# Altium project Attiny.PrjPCB
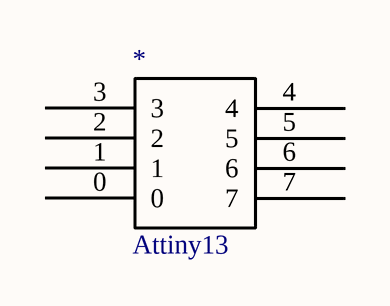
[diagram p0: Attiny.SchDoc]
1 sheet, 1 parts. Net scope: global (net labels, ports and power ports of the same name join across sheets).
Board file: Attiny.PcbDoc

## Sheet Attiny.SchDoc
size A4

### Parts
*  Attiny13  [ATTINY13]

### Nets

Not connected (* = marked no-connect by the designer): * 0 1 2 3 4 5 6 7